# Altium schematic sheet USB to UART Bridge.SchDoc: USB to UART Bridge
size B; Organization: Drexel University; Address1: ECE Senior Design; Address2: 2018-2019; Address3: ECE-08; Revision: 1.0; SheetNumber: 5; SheetTotal: 9
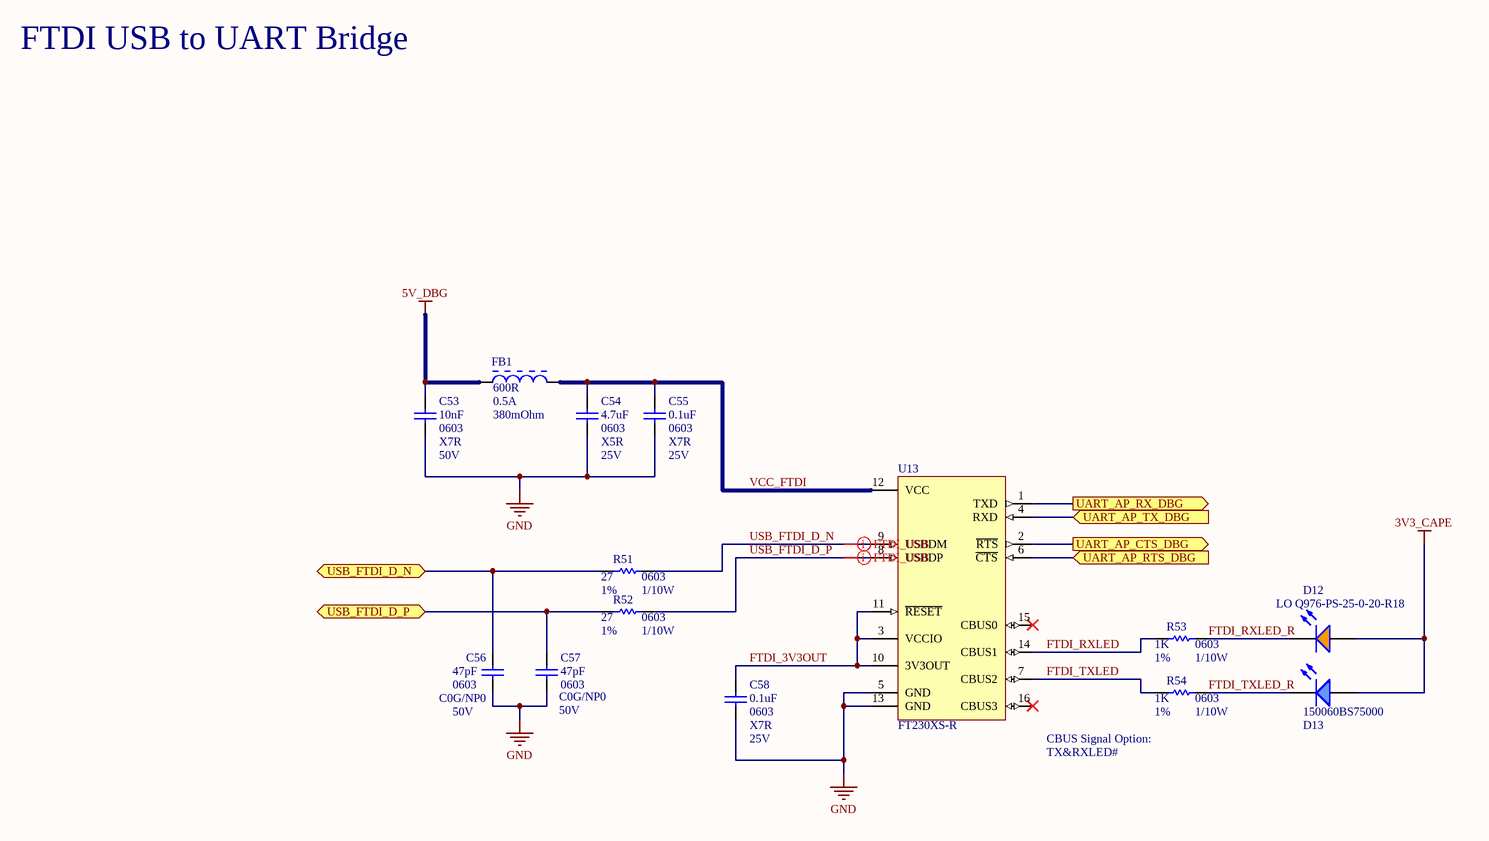
[diagram p0: USB to UART Bridge.SchDoc]

## Parts
C53  Capacitance: 10nF  Package: 0603  Voltage Rating: 50V  Temperature Coefficient: X7R  [PCB-d5hkaaevye8vfvwu9osi-1]  (hidden comment: Cap)
C54  Capacitance: 4.7uF  Case/Package: 0603  Dielectric Characteristic: X5R  Voltage Rating (DC): 25V  [CAPC1608X90X35ML10T15]  (hidden comment: Murata GRM188R61E475KE11D)
C55  Dielectric Characteristic: X7R  Voltage Rating (DC): 25V  Capacitance: 0.1uF  Package: 0603  [PCB-8usp83j76ntw2xroyu3n-1]  (hidden comment: Würth Elektronik 885012206071)
C56  Capacitance: 47pF  Dielectric Characteristic: C0G/NP0  Voltage Rating (DC): 50V  Package: 0603  [PCB-6hp2bdit6vqlyhs5eujf-1]  (hidden comment: Würth Elektronik 885012006055)
C57  Capacitance: 47pF  Dielectric Characteristic: C0G/NP0  Voltage Rating (DC): 50V  Package: 0603  [PCB-6hp2bdit6vqlyhs5eujf-1]  (hidden comment: Würth Elektronik 885012006055)
C58  Dielectric Characteristic: X7R  Voltage Rating (DC): 25V  Capacitance: 0.1uF  Package: 0603  [PCB-8usp83j76ntw2xroyu3n-1]  (hidden comment: Würth Elektronik 885012206071)
D12  LO Q976-PS-25-0-20-R18  [PCB-zc2vv3u4p0giaiwimi3e-1]
D13  150060BS75000  [PCB-q13q7q9xcpj9ke5g4s5g-1]
FB1  Impedance: 600R  Current Rating: 0.5A  DCR: 380mOhm  [PCB-4foxbpplo5x4nzr4ivga-1]  (hidden comment: SYM-440c8e25a3239bcb-1)
R51  Resistance: 27  Power Rating: 1/10W  Case/Package: 0603  Resistance Tolerance: 1%  [0603-RES]  (hidden comment: Panasonic / Panasonic ECG ERJ-3EKF27R0V)
R52  Resistance: 27  Power Rating: 1/10W  Case/Package: 0603  Resistance Tolerance: 1%  [0603-RES]  (hidden comment: Panasonic / Panasonic ECG ERJ-3EKF27R0V)
R53  Case/Package: 0603  Power Rating: 1/10W  Resistance: 1K  Resistance Tolerance: 1%  [PCB-rzdzs5ckhrcob8ss0hvn-1]  (hidden comment: Stackpole Electronics RMCF0603FT1K00)
R54  Case/Package: 0603  Power Rating: 1/10W  Resistance: 1K  Resistance Tolerance: 1%  [PCB-rzdzs5ckhrcob8ss0hvn-1]  (hidden comment: Stackpole Electronics RMCF0603FT1K00)
U13  FT230XS-R  [SSOP16-0.635-5X4MM]

## Ports
UART_AP_CTS_DBG (out), UART_AP_RTS_DBG (in), UART_AP_RX_DBG (out), UART_AP_TX_DBG (in), USB_FTDI_D_N, USB_FTDI_D_P (bidir)

## Nets
3V3_CAPE: D12.1(A) D13.2(A)
5V_DBG: C53.2 FB1.1
GND: C53.1 C54.1 C55.1 C56.1 C57.1 C58.1 U13.5(GND) U13.13(GND)
FTDI_3V3OUT: C58.2 U13.3(VCCIO) U13.10(3V3OUT) U13.11(~{RESET})
FTDI_RXLED: R53.2 U13.14(CBUS1)
FTDI_RXLED_R: D12.2(K) R53.1
FTDI_TXLED: R54.2 U13.7(CBUS2)
FTDI_TXLED_R: D13.1(K) R54.1
UART_AP_CTS_DBG: U13.2(~{RTS}) ; port UART_AP_CTS_DBG
UART_AP_RTS_DBG: U13.6(~{CTS}) ; port UART_AP_RTS_DBG
UART_AP_RX_DBG: U13.1(TXD) ; port UART_AP_RX_DBG
UART_AP_TX_DBG: U13.4(RXD) ; port UART_AP_TX_DBG
USB_FTDI_D_N: R51.2 U13.9(USBDM)
USB_FTDI_D_N: C56.2 R51.1 ; port USB_FTDI_D_N  [a separate net that carries the same name]
USB_FTDI_D_P: R52.2 U13.8(USBDP)
USB_FTDI_D_P: C57.2 R52.1 ; port USB_FTDI_D_P  [a separate net that carries the same name]
VCC_FTDI: C54.2 C55.2 FB1.2 U13.12(VCC)

Not connected (* = marked no-connect by the designer): U13 15(CBUS0)* 16(CBUS3)*

## Layout directives
differential pair: USB_FTDI_D_N, USB_FTDI_D_P

## Notes on the sheet
- FTDI USB to UART Bridge
- CBUS Signal Option:
- TX&RXLED#
- Title
- Size:
- Date:
- B
- Number:
- Time:
- Revision:
- Sheet
- of
- File:

## Library data of the parts
C53 = CMP-96115e35287049d6-7: CL10 Series 0603 50 V 10 nF X7R ±10% Tolerance Multilayer Ceramic Capacitor; Capacitance Tolerance: ±10%
C54 = CMP-8856396-4: CAP CER 4.7UF 25V 10% X5R 0603; Capacitance Tolerance: ±10%; Lifecycle Status: Active; Octopart Url: https://octopart.com/grm188r61e475ke11d-murata-26982327; OctopartID: 0176c9e793a7deb1; Packaging: Cut Tape (CT); REACH SVHC Compliance: No SVHC; RoHS: Compliant; Size-Length: 0.0016 m; Size-Thickness: 0.0008 m; Size-Width: 0.0008 m; Manufacturer Part Number: GRM188R61E475KE11D
C55 C58 = CMP-034ac9768ab0dc8d-1: Multilayer Ceramic Capacitor, WCAP-CSGP Series, 0.1 F, 10%, X7R, 25 V, 0603 [1608 Metric]; RoHS: Compliant; Capacitance Tolerance: ±10%; OctopartID: 034ac9768ab0dc8d; Packaging: Cut Tape (CT); Octopart URL: http://octopart.com/885012206071-w%C3%BCrth+elektronik-53914780; Manufacturer Part Number: 885012206071
C56 C57 = CMP-bdcf7723a1936208-1: Cap, Mlcc, Np0, 47Pf, 50V, 0603; Capacitance Tolerance: ±5%; Octopart URL: https://octopart.com/885012006055-w%C3%BCrth+elektronik-65419578; Manufacturer Part Number: 885012006055; Operating Temperature: -55.0 °C (min); Packaging: Cut Tape (CT); RoHS: Compliant; OctopartID: bdcf7723a1936208
D12 = CMP-b572780b9ff46ab5-2: LED Uni-Color Orange 0.74lm 610nm Chip LED 2-Pin SMD T/R; OctopartID: b572780b9ff46ab5; Manufacturer Part Number: LO Q976-PS-25-0-20-R18; Octopart URL: https://octopart.com/lo+q976-ps-25-0-20-r18-osram+opto-74649568
D13 = CMP-12518856-7: Standard LEDs - SMD WL-SMCW SMDMono TpVw Waterclr 0603 Blue; Viewing Angle: 140 °; Luminous Intensity: 145 mcd; Forward Voltage: 3.20 V; Case/Package: 0603; Color: Blue; Octopart URL: http://octopart.com/150060bs75000-w%C3%BCrth+elektronik-29717775; RoHS: Compliant; Mounting Style: Surface Mount; Manufacturer Part Number: 150060BS75000; OctopartID: cf0a07c59f6310cd; Packaging: Cut Tape (CT)
FB1 = CMP-440c8e25a3239bcb-1: Ind Chip Bead Multi-Layer 600 Ohm 25% 100MHz Ferrite 500mA 0603 T/R; Manufacturer Part Number: PE-0603FB601ST; OctopartID: 440c8e25a3239bcb
R51 R52 = CMP-f61f3f990ffb29d8-2: Res Thick Film 0603 27 Ohm 1% 0.1W(1/10W) ±100ppm/C Molded SMD Automotive Punched T/R; Lead-Free Status: Lead Free; Voltage Rating (DC): 75.0 V; Manufacturer Part Number: ERJ-3EKF27R0V; RoHS: Compliant; OctopartID: f61f3f990ffb29d8; Number of Pins: 2; Mounting Style: Surface Mount; Seller Landing  Url: https://octopart-clicks.com/click/track?country=US&ak=8157f166&sig=00bb2fd&sid=459&ppid=9231490&vpid=115259536&ct=offers; Lifecycle Status: Not Listed by Manufacturer; Octopart Url: http://octopart.com/erj-3ekf27r0v-panasonic-9231490; REACH SVHC Compliance: No SVHC; Packaging: Tape & Reel (TR), Cut Tape (CT)
R53 R54 = CMP-fdb3359cf2042274-2: RMCF Series 0603 0.1 W 1 kOhm ±1 % ±100 ppm/°C SMT Thick Film Chip Resistor; Lead-Free Status: Lead Free; Packaging: Tape & Reel (TR); Octopart URL: http://octopart.com/rmcf0603ft1k00-stackpole+electronics-19213009; Mounting Style: Surface Mount; OctopartID: fdb3359cf2042274; RoHS: Compliant; Manufacturer Part Number: RMCF0603FT1K00
U13 = CMP-1315826-9: Interface; USB-basic UART; Number of pins CBUS: 4; tape; SSOP16; Company: FTDI; OctopartID: 8b06435c0fa154c1; Mounting Style: Surface Mount; Manufacturer Part Number: FT230XS-R; Octopart Url: http://octopart.com/ft230xs-r-ftdi-22061505; Seller Landing  Url: https://octopart-clicks.com/click/track?country=US&ak=8157f166&sig=0eeb63a&sid=5489&ppid=22061505&vpid=88166844&ct=offers; Packaging: Tape; RoHS: Compliant